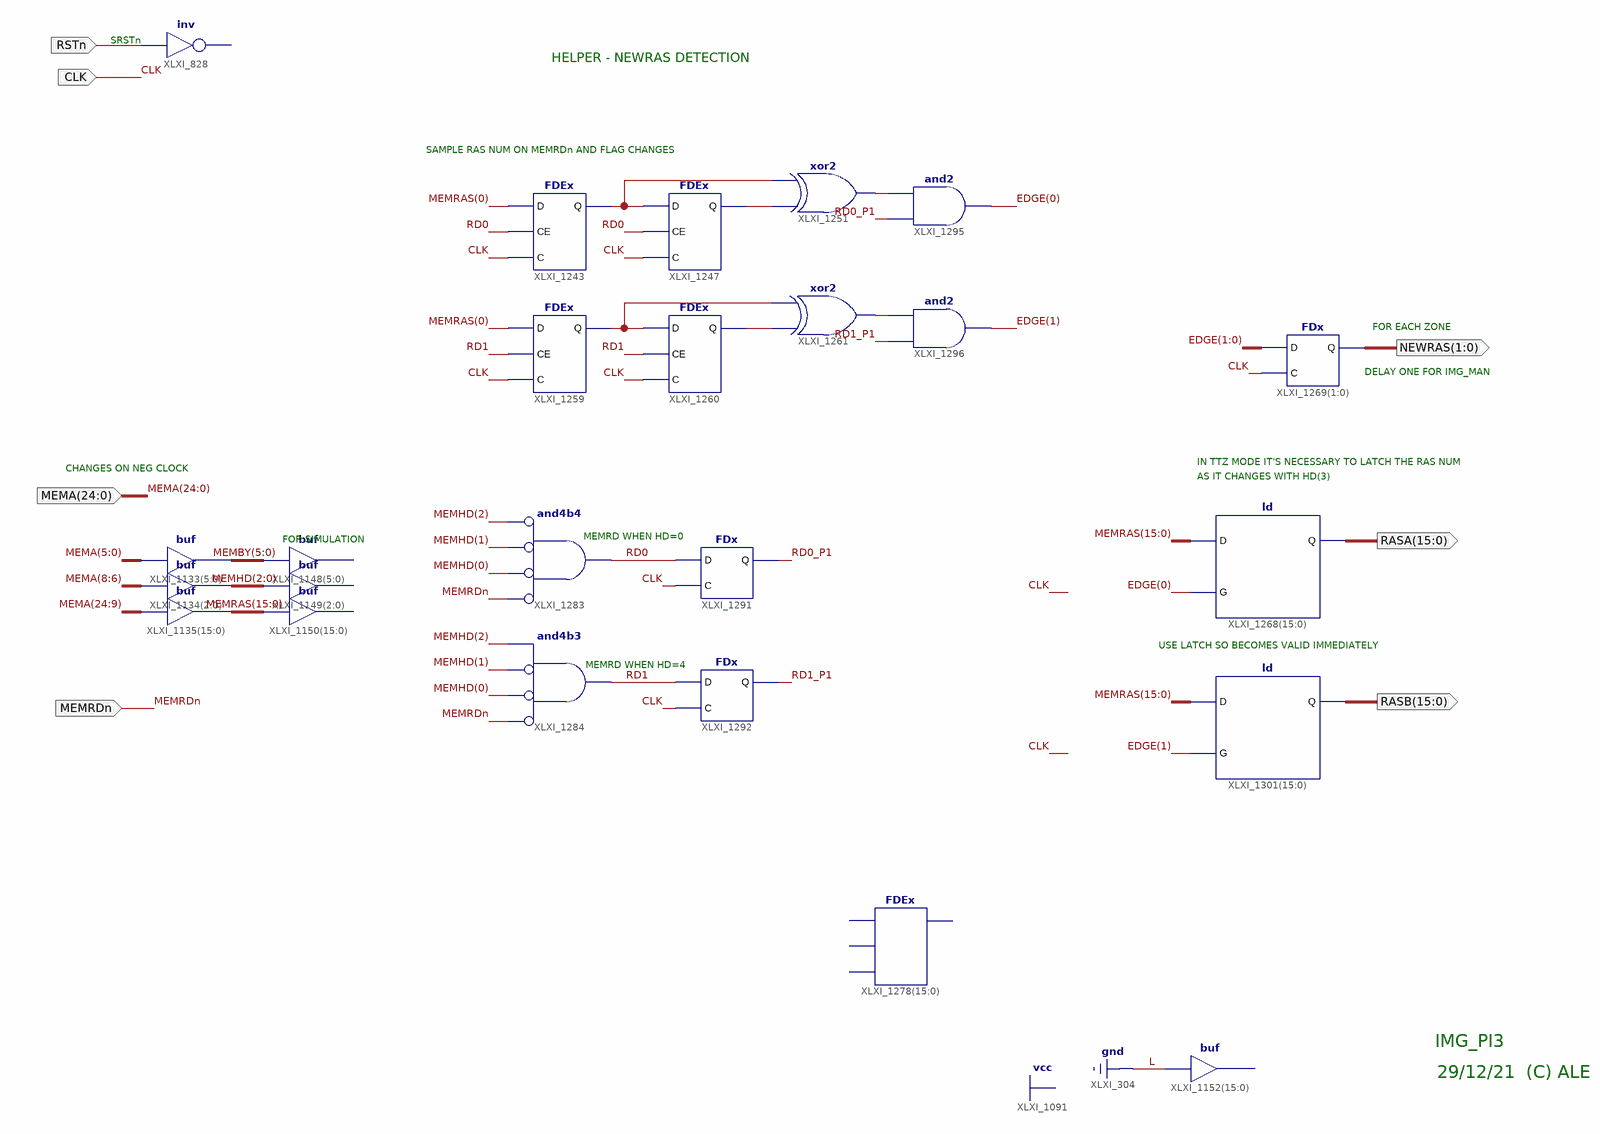
[diagram p0: schematic sheet 1]
// Xilinx ISE schematic Img_Pi3.sch (spartan3e) as structural Verilog: 24 symbols, 7 ports
module Img_Pi3 (
  input  CLK,
  input  RSTn,
  input  [24:0] MEMA,
  input  MEMRDn,
  output [1:0] NEWRAS,
  output [15:0] RASA,
  output [15:0] RASB
);

  wire RD0, RD0_P1, RD1, RD1_P1, XLXN_387, XLXN_397, XLXN_421, XLXN_423, XLXN_484, XLXN_487;
  wire [1:0] EDGE;
  wire [2:0] MEMHD;
  wire [5:0] MEMBY;
  wire [15:0] MEMRAS;

  // inv XLXI_828 has open pins: I=RSTn, O=open
  // buf XLXI_1152[15..0] has open pins: I=1'b0, O=open
  assign MEMBY = MEMA[5:0];  // buf XLXI_1133[5..0], 6 bits wide
  assign MEMHD = MEMA[8:6];  // buf XLXI_1134[2..0], 3 bits wide
  assign MEMRAS = MEMA[24:9];  // buf XLXI_1135[15..0], 16 bits wide
  // buf XLXI_1150[15..0] has open pins: I=MEMRAS, O=open
  // buf XLXI_1149[2..0] has open pins: I=MEMHD, O=open
  // buf XLXI_1148[5..0] has open pins: I=MEMBY, O=open
  ld XLXI_1268[15:0] (.D(MEMRAS), .G(EDGE[0]), .Q(RASA));
  and XLXI_1283 (RD0, ~MEMRDn, ~MEMHD[0], ~MEMHD[1], ~MEMHD[2]);  // and4b4
  and XLXI_1284 (RD1, ~MEMRDn, ~MEMHD[0], ~MEMHD[1], MEMHD[2]);  // and4b3
  FDEx XLXI_1259 (.C(CLK), .CE(RD1), .D(MEMRAS[0]), .Q(XLXN_423));
  FDEx XLXI_1260 (.C(CLK), .CE(RD1), .D(XLXN_423), .Q(XLXN_421));
  FDEx XLXI_1247 (.C(CLK), .CE(RD0), .D(XLXN_397), .Q(XLXN_387));
  FDEx XLXI_1243 (.C(CLK), .CE(RD0), .D(MEMRAS[0]), .Q(XLXN_397));
  FDx XLXI_1291 (.C(CLK), .D(RD0), .Q(RD0_P1));
  FDx XLXI_1292 (.C(CLK), .D(RD1), .Q(RD1_P1));
  xor XLXI_1261 (XLXN_487, XLXN_421, XLXN_423);
  xor XLXI_1251 (XLXN_484, XLXN_387, XLXN_397);
  and XLXI_1295 (EDGE[0], RD0_P1, XLXN_484);
  and XLXI_1296 (EDGE[1], RD1_P1, XLXN_487);
  FDx XLXI_1269[1:0] (.C(CLK), .D(EDGE), .Q(NEWRAS));
  FDEx XLXI_1278[15:0] ();  // open: C, CE, D, Q
  ld XLXI_1301[15:0] (.D(MEMRAS), .G(EDGE[1]), .Q(RASB));

  // Notes on the sheet:
  //   SRSTn
  //   HELPER - NEWRAS DETECTION
  //   SAMPLE RAS NUM ON MEMRDn AND FLAG CHANGES
  //   FOR EACH ZONE
  //   DELAY ONE FOR IMG_MAN
  //   IN TTZ MODE IT'S NECESSARY TO LATCH THE RAS NUM
  //   CHANGES ON NEG CLOCK
  //   AS IT CHANGES WITH HD(3)
  //   MEMRD WHEN HD=0
  //   FOR SIMULATION
  //   USE LATCH SO BECOMES VALID IMMEDIATELY
  //   MEMRD WHEN HD=4
  //   IMG_PI3
  //   29/12/21  (C) ALE
endmodule
